# Altium project AirPi_Power.PrjPcb
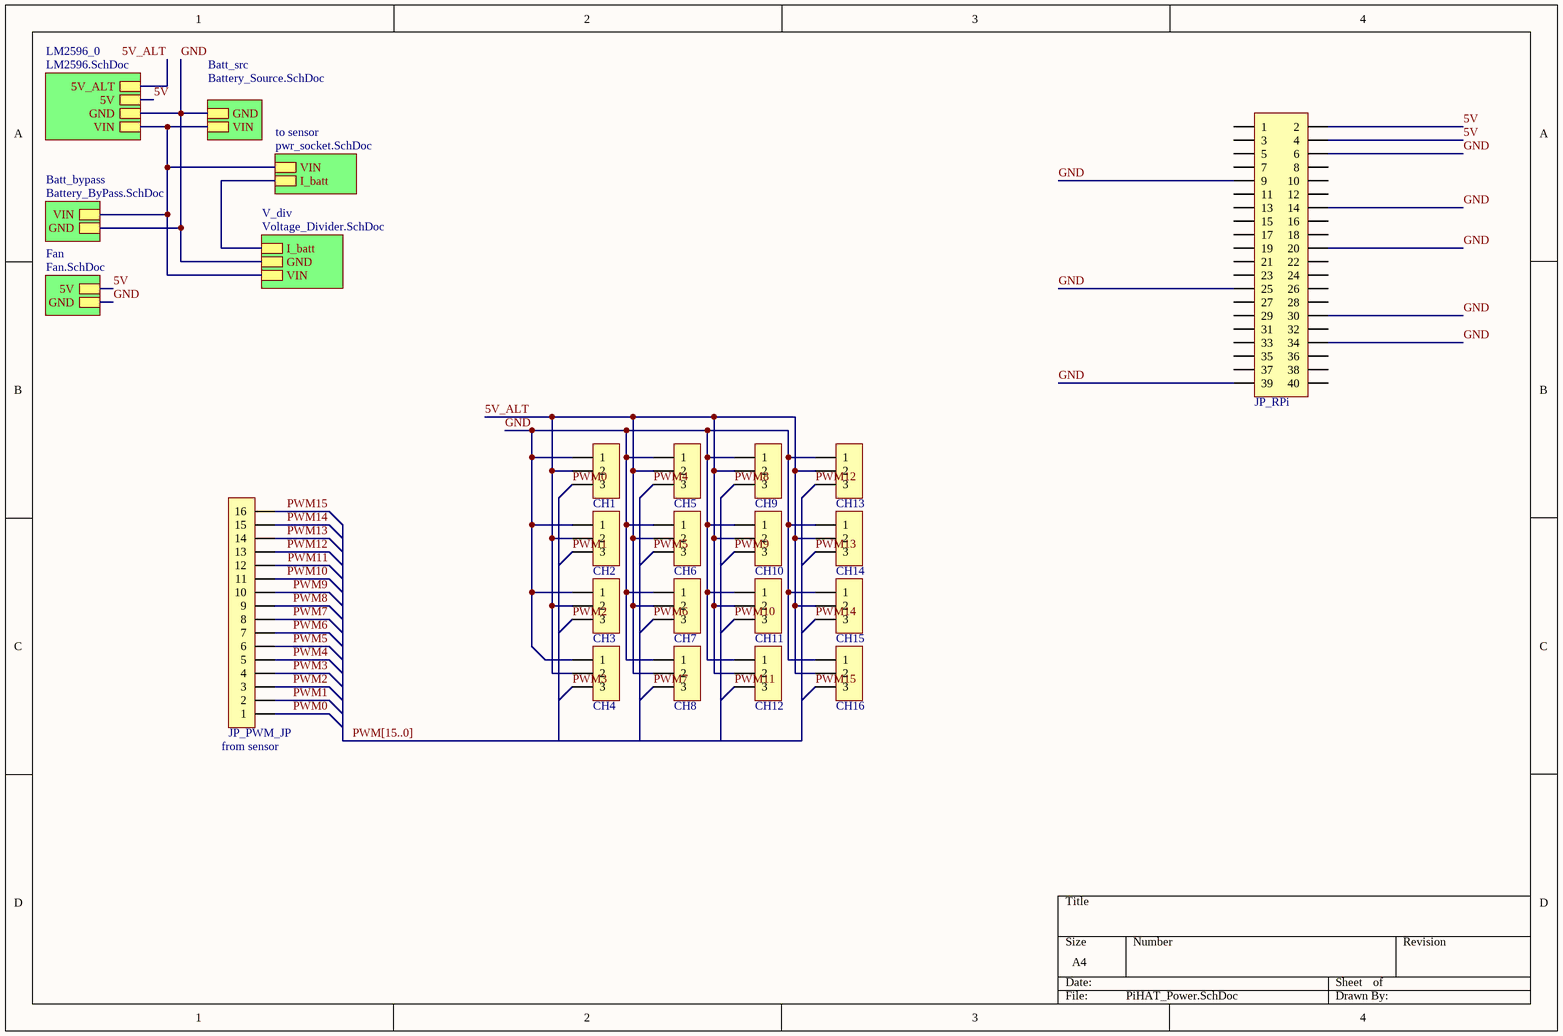
[diagram p0: PiHAT_Power.SchDoc]
7 sheets, 44 parts. Net scope: hierarchical (ports join the sheet entries above them; power ports are global).
Board file: AirPi_Power.PcbDoc
Sheets:
  PiHAT_Power.SchDoc
    LM2596_0 = LM2596.SchDoc
    Batt_src = Battery_Source.SchDoc
    Batt_bypass = Battery_ByPass.SchDoc
    Fan = Fan.SchDoc
    V_div = Voltage_Divider.SchDoc
    to sensor = pwr_socket.SchDoc

## Sheet PiHAT_Power.SchDoc
size A4

### Parts
CH1  HDR-1X3  [HDR2.54-LI-3P]  (value not drawn)
CH2  HDR-1X3  [HDR2.54-LI-3P]  (value not drawn)
CH3  HDR-1X3  [HDR2.54-LI-3P]  (value not drawn)
CH4  HDR-1X3  [HDR2.54-LI-3P]  (value not drawn)
CH5  HDR-1X3  [HDR2.54-LI-3P]  (value not drawn)
CH6  HDR-1X3  [HDR2.54-LI-3P]  (value not drawn)
CH7  HDR-1X3  [HDR2.54-LI-3P]  (value not drawn)
CH8  HDR-1X3  [HDR2.54-LI-3P]  (value not drawn)
CH9  HDR-1X3  [HDR2.54-LI-3P]  (value not drawn)
CH10  HDR-1X3  [HDR2.54-LI-3P]  (value not drawn)
CH11  HDR-1X3  [HDR2.54-LI-3P]  (value not drawn)
CH12  HDR-1X3  [HDR2.54-LI-3P]  (value not drawn)
CH13  HDR-1X3  [HDR2.54-LI-3P]  (value not drawn)
CH14  HDR-1X3  [HDR2.54-LI-3P]  (value not drawn)
CH15  HDR-1X3  [HDR2.54-LI-3P]  (value not drawn)
CH16  HDR-1X3  [HDR2.54-LI-3P]  (value not drawn)
JP_PWM_JP  HDR-1X16  [HDR2.54-M-LI-16P]  (value not drawn)
JP_RPi  Header 2X11  [HDR2.54-LI-2x20P]  (value not drawn)

### Sub-sheets
Batt_bypass = Battery_ByPass.SchDoc: GND, VIN
Batt_src = Battery_Source.SchDoc: GND, VIN
Fan = Fan.SchDoc: 5V, GND
LM2596_0 = LM2596.SchDoc: 5V, GND, VIN, 5V_ALT
to sensor = pwr_socket.SchDoc: I_batt, VIN
V_div = Voltage_Divider.SchDoc: I_batt, GND, VIN

### Nets
5V: JP_RPi.2 JP_RPi.4 ; sheet LM2596_0/5V, sheet Fan/5V
5V_ALT: CH1.2 CH2.2 CH3.2 CH4.2 CH5.2 CH6.2 CH7.2 CH8.2 CH9.2 CH10.2 CH11.2 CH12.2 CH13.2 CH14.2 CH15.2 CH16.2 ; sheet LM2596_0/5V_ALT
GND: CH1.1 CH2.1 CH3.1 CH4.1 CH5.1 CH6.1 CH7.1 CH8.1 CH9.1 CH10.1 CH11.1 CH12.1 CH13.1 CH14.1 CH15.1 CH16.1 JP_RPi.6 JP_RPi.9 JP_RPi.14 JP_RPi.20 JP_RPi.25 JP_RPi.30 JP_RPi.34 JP_RPi.39 ; sheet LM2596_0/GND, sheet Batt_src/GND, sheet Batt_bypass/GND, sheet Fan/GND, sheet V_div/GND
PWM0: CH1.3 JP_PWM_JP.1
PWM1: CH2.3 JP_PWM_JP.2
PWM2: CH3.3 JP_PWM_JP.3
PWM3: CH4.3 JP_PWM_JP.4
PWM4: CH5.3 JP_PWM_JP.5
PWM5: CH6.3 JP_PWM_JP.6
PWM6: CH7.3 JP_PWM_JP.7
PWM7: CH8.3 JP_PWM_JP.8
PWM8: CH9.3 JP_PWM_JP.9
PWM9: CH10.3 JP_PWM_JP.10
PWM10: CH11.3 JP_PWM_JP.11
PWM11: CH12.3 JP_PWM_JP.12
PWM12: CH13.3 JP_PWM_JP.13
PWM13: CH14.3 JP_PWM_JP.14
PWM14: CH15.3 JP_PWM_JP.15
PWM15: CH16.3 JP_PWM_JP.16
NetC2_2: sheet LM2596_0/VIN, sheet Batt_src/VIN, sheet Batt_bypass/VIN, sheet V_div/VIN, sheet to sensor/VIN
NetJP_PWR_MON_2: sheet V_div/I_batt, sheet to sensor/I_batt

Not connected (* = marked no-connect by the designer): JP_RPi 1 3 5 7 8 10 11 12 13 15 16 17 18 19 21 22 23 24 26 27 28 29 31 32 33 35 36 37 38 40

### Buses and harness runs
bus PWM[15..0]

### Notes on the sheet
- (near JP_PWM_JP) from sensor

### Library data of the parts
CH1-CH16 = Header 3: 3P接插件; 版权归属: 源创客; BOM名称: 3P接插件; 学习资源: www.ooocke.com
JP_PWM_JP = Header 16: 16P接插件; 版权归属: 源创客; BOM名称: 16P接插件; 学习资源: www.ooocke.com
JP_RPi = Header 20X2: 20*2P接插件; 版权归属: 源创客; BOM名称: 20*2P接插件; 学习资源: www.ooocke.com

## Sheet LM2596.SchDoc
size A4
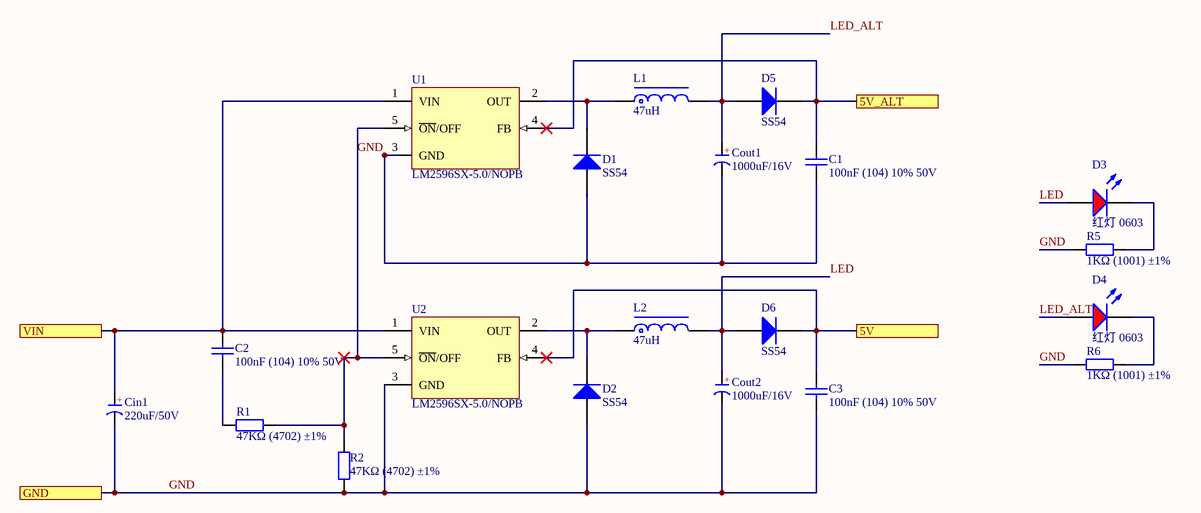
[diagram p1: LM2596.SchDoc]

### Parts
C1  100nF (104) 10% 50V  [0603_C]
C2  100nF (104) 10% 50V  [0603_C]
C3  100nF (104) 10% 50V  [0603_C]
Cin1  220uF/50V  [CM F(10*10.2)]
Cout1  1000uF/16V  [CM F(10*10.2)]
Cout2  1000uF/16V  [CM F(10*10.2)]
D1  SS54  [SMA(DO-214AC)_S1]
D2  SS54  [SMA(DO-214AC)_S1]
D3  红灯 0603  [0603_LED_S1]
D4  红灯 0603  [0603_LED_S1]
D5  SS54  [SMA(DO-214AC)_S1]
D6  SS54  [SMA(DO-214AC)_S1]
L1  47uH  [CDRH127]
L2  47uH  [CDRH127]
R1  47KΩ (4702) ±1%  [0402_R]
R2  47KΩ (4702) ±1%  [0402_R]
R5  1KΩ (1001) ±1%  [0402_R]
R6  1KΩ (1001) ±1%  [0402_R]
U1  LM2596SX-5.0/NOPB  [TO-263-5]
U2  LM2596SX-5.0/NOPB  [TO-263-5]

### Ports
5V, 5V_ALT, GND, VIN

### Nets
5V: C3.2 D6.2(K) U2.4(FB) ; port 5V
5V_ALT: C1.2 D5.2(K) U1.4(FB) ; port 5V_ALT
GND: C1.1 C3.1 Cin1.2(K) Cout1.2(K) Cout2.2(K) D1.1(A) D2.1(A) R2.1 R5.1 R6.1 U1.3(GND) U2.3(GND) ; port GND
LED: Cout2.1(A) D3.A D6.1(A) L2.2
LED_ALT: Cout1.1(A) D4.A D5.1(A) L1.2
NetC2_1: C2.1 R1.1
NetC2_2: C2.2 Cin1.1(A) U1.1(VIN) U2.1(VIN) ; port VIN
NetD1_2: D1.2(K) L1.1 U1.2(OUT)
NetD2_2: D2.2(K) L2.1 U2.2(OUT)
NetD3_K: D3.K R5.2
NetD4_K: D4.K R6.2
NetR1_2: R1.2 R2.2 U1.5(~{ON}/OFF) U2.5(~{ON}/OFF)

### Notes on the sheet
- (in symbol C-CM) +

### Library data of the parts
C1-C3 = 0603 100nF (104) 10% 50V: 贴片电容; ComponentLink1Description: 供应商链接; ComponentLink1URL: http://www.szlcsc.com/product/details_15331.html; Package: 0603; Supplier: LC; SuppliersPartNumber: C14663
Cin1 Cout1 Cout2 = C-CM: 贴片电解电容; 版权归属: 源创客; BOM名称: 贴片电解电容; 学习资源: www.ooocke.com
D1 D2 D5 D6 = SMA(DO-214AC) SS54: 二极管; ComponentLink1Description: 供应商链接; ComponentLink1URL: http://www.szlcsc.com/product/details_23178.html; Package: SMA(DO-214AC); Supplier: LC; SuppliersPartNumber: C22452
D3 D4 = 0603 红灯: 发光二极管; ComponentLink1Description: 供应商链接; ComponentLink1URL: http://www.szlcsc.com/product/details_2659.html; Package: 0603; Supplier: LC; SuppliersPartNumber: C2286
L1 L2 = L-CDRH: 功率屏蔽电感; 版权归属: 源创客; BOM名称: 功率屏蔽电感; 学习资源: www.ooocke.com
R1 R2 = 0402 47KΩ (4702) 1%: 贴片电阻; ComponentLink1Description: 供应商链接; ComponentLink1URL: http://www.szlcsc.com/product/details_26535.html; Package: 0402; Supplier: LC; SuppliersPartNumber: C25792
R5 R6 = 0402 1KΩ (1001) 1%: 贴片电阻; ComponentLink1Description: 供应商链接; ComponentLink1URL: http://www.szlcsc.com/product/details_12256.html; Package: 0402; Supplier: LC; SuppliersPartNumber: C11702
U1 U2 = LM2596SX-5.0/NOPB_[C10002]: DC-DC芯片; ComponentLink1Description: 供应商链接; ComponentLink1URL: http://www.szlcsc.com/product/details_10538.html; Package: TO-263-5; Supplier: LC; SuppliersPartNumber: C10002

## Sheet Battery_Source.SchDoc
size A4
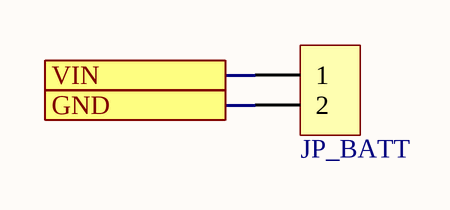
[diagram p2: Battery_Source.SchDoc]

### Parts
JP_BATT  HDR-1X2  [XH2.54-WI-2P]  (value not drawn)

### Ports
GND, VIN

### Nets
GND: JP_BATT.2 ; port GND
NetC2_2: JP_BATT.1 ; port VIN

### Library data of the parts
JP_BATT = Header 2: 2P接插件; 版权归属: 源创客; BOM名称: 2P接插件; 学习资源: www.ooocke.com

## Sheet Battery_ByPass.SchDoc
size A4
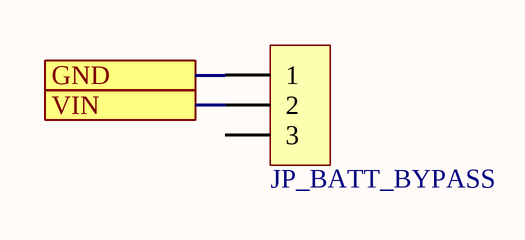
[diagram p3: Battery_ByPass.SchDoc]

### Parts
JP_BATT_BYPASS  HDR-1X3  [HDR2.54-LI-3P]  (value not drawn)

### Ports
GND, VIN

### Nets
GND: JP_BATT_BYPASS.1 ; port GND
NetC2_2: JP_BATT_BYPASS.2 ; port VIN

Not connected (* = marked no-connect by the designer): JP_BATT_BYPASS 3

### Library data of the parts
JP_BATT_BYPASS = Header 3: 3P接插件; 版权归属: 源创客; BOM名称: 3P接插件; 学习资源: www.ooocke.com

## Sheet Fan.SchDoc
size A4
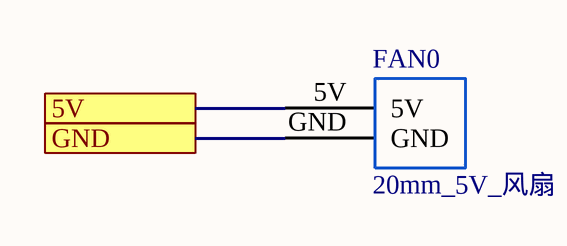
[diagram p4: Fan.SchDoc]

### Parts
FAN0  20mm_5V_风扇  [20mmFAN]

### Ports
5V, GND

### Nets
5V: FAN0.5V ; port 5V
GND: FAN0.GND ; port GND

### Library data of the parts
FAN0 = 20mmFAN: pin to pad: 5V>7 GND>6

## Sheet Voltage_Divider.SchDoc
size A4
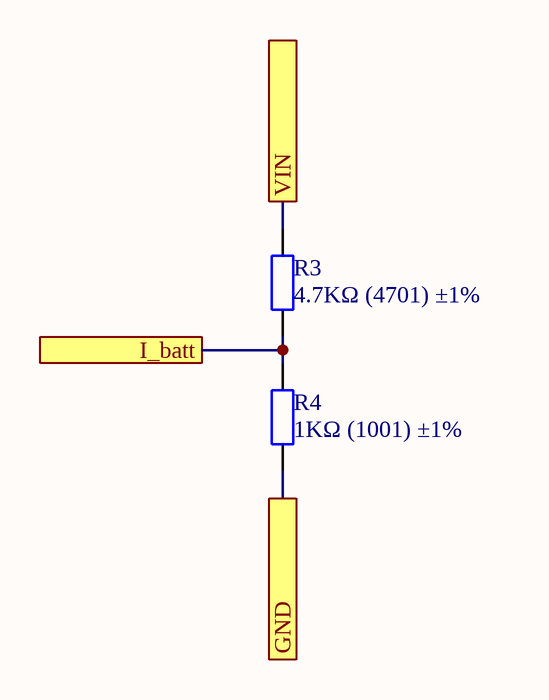
[diagram p5: Voltage_Divider.SchDoc]

### Parts
R3  4.7KΩ (4701) ±1%  [0402_R]
R4  1KΩ (1001) ±1%  [0402_R]

### Ports
GND, I_batt, VIN

### Nets
GND: R4.1 ; port GND
NetC2_2: R3.2 ; port VIN
NetJP_PWR_MON_2: R3.1 R4.2 ; port I_batt

### Library data of the parts
R3 = 0402 4.7KΩ (4701) 1%: 贴片电阻; ComponentLink1Description: 供应商链接; ComponentLink1URL: http://www.szlcsc.com/product/details_26643.html; Package: 0402; Supplier: LC; SuppliersPartNumber: C25900
R4 = 0402 1KΩ (1001) 1%: 贴片电阻; ComponentLink1Description: 供应商链接; ComponentLink1URL: http://www.szlcsc.com/product/details_12256.html; Package: 0402; Supplier: LC; SuppliersPartNumber: C11702

## Sheet pwr_socket.SchDoc
size A4
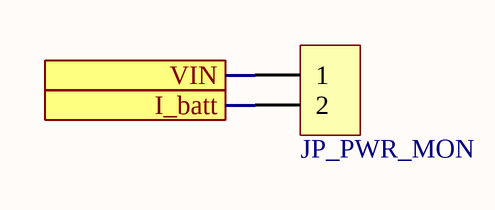
[diagram p6: pwr_socket.SchDoc]

### Parts
JP_PWR_MON  HDR-1X2  [HDR2.54-M-LI-2P]  (value not drawn)

### Ports
I_batt, VIN

### Nets
NetC2_2: JP_PWR_MON.1 ; port VIN
NetJP_PWR_MON_2: JP_PWR_MON.2 ; port I_batt

### Library data of the parts
JP_PWR_MON = Header 2: 2P接插件; 版权归属: 源创客; BOM名称: 2P接插件; 学习资源: www.ooocke.com

## Nets that join several sheets
5V: PiHAT_Power (JP_RPi.2 JP_RPi.4), LM2596 (C3.2 D6.2 U2.4), Fan (FAN0.5V)
5V_ALT: PiHAT_Power (16 pins), LM2596 (C1.2 D5.2 U1.4)
GND: PiHAT_Power (24 pins), LM2596 (12 pins), Battery_Source (JP_BATT.2), Battery_ByPass (JP_BATT_BYPASS.1), Fan (FAN0.GND), Voltage_Divider (R4.1)
NetC2_2: LM2596 (C2.2 Cin1.1 U1.1 U2.1), Battery_Source (JP_BATT.1), Battery_ByPass (JP_BATT_BYPASS.2), Voltage_Divider (R3.2), pwr_socket (JP_PWR_MON.1)
NetJP_PWR_MON_2: Voltage_Divider (R3.1 R4.2), pwr_socket (JP_PWR_MON.2)